# Altium schematic sheet LionIRVT-Base.SchDoc
size A4
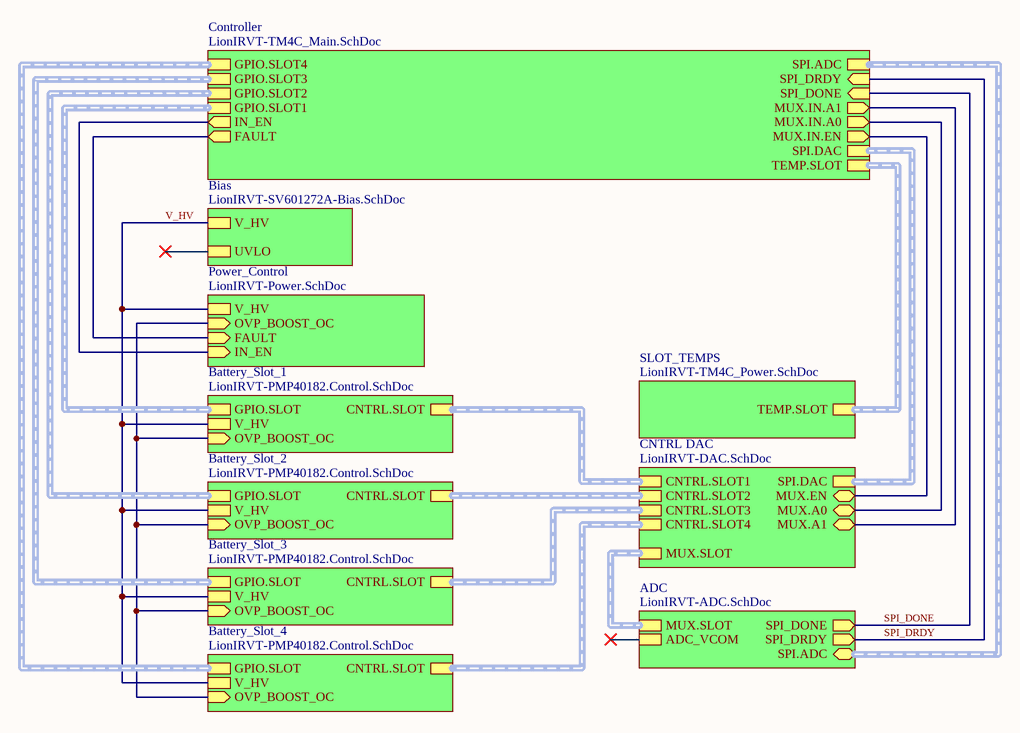
[diagram p0: LionIRVT-Base.SchDoc]

## Sub-sheets
ADC = LionIRVT-ADC.SchDoc: ADC_VCOM, SPI.ADC (bidir, harness SPI), SPI_DRDY (out), SPI_DONE (out), MUX.SLOT (harness MUX.SLOT)
Battery_Slot_1 = LionIRVT-PMP40182.Control.SchDoc: OVP_BOOST_OC (in), V_HV, CNTRL.SLOT (harness CNTRL.SLOT), GPIO.SLOT (harness GPIO.SLOT)
Battery_Slot_2 = LionIRVT-PMP40182.Control.SchDoc: OVP_BOOST_OC (in), V_HV, CNTRL.SLOT (harness CNTRL.SLOT), GPIO.SLOT (harness GPIO.SLOT)
Battery_Slot_3 = LionIRVT-PMP40182.Control.SchDoc: OVP_BOOST_OC (in), V_HV, CNTRL.SLOT (harness CNTRL.SLOT), GPIO.SLOT (harness GPIO.SLOT)
Battery_Slot_4 = LionIRVT-PMP40182.Control.SchDoc: OVP_BOOST_OC (in), V_HV, CNTRL.SLOT (harness CNTRL.SLOT), GPIO.SLOT (harness GPIO.SLOT)
Bias = LionIRVT-SV601272A-Bias.SchDoc: V_HV, UVLO
CNTRL DAC = LionIRVT-DAC.SchDoc: SPI.DAC (harness SPI), MUX.SLOT (harness MUX.SLOT), MUX.A0 (bidir), CNTRL.SLOT1 (harness CNTRL.SLOT), CNTRL.SLOT2 (harness CNTRL.SLOT), MUX.A1 (bidir), CNTRL.SLOT4 (harness CNTRL.SLOT), CNTRL.SLOT3 (harness CNTRL.SLOT), MUX.EN (bidir)
Controller = LionIRVT-TM4C_Main.SchDoc: SPI.DAC (harness SPI), SPI.ADC (harness SPI), SPI_DONE (in), SPI_DRDY (in), MUX.IN.EN (out), MUX.IN.A1 (out), MUX.IN.A0 (out), FAULT (out), IN_EN (out), GPIO.SLOT1 (harness GPIO.SLOT), GPIO.SLOT2 (harness GPIO.SLOT), GPIO.SLOT3 (harness GPIO.SLOT), GPIO.SLOT4 (harness GPIO.SLOT), TEMP.SLOT (harness TEMP.SLOT)
Power_Control = LionIRVT-Power.SchDoc: IN_EN (in), V_HV, OVP_BOOST_OC (in), FAULT (in)
SLOT_TEMPS = LionIRVT-TM4C_Power.SchDoc: TEMP.SLOT (harness TEMP.SLOT)

## Nets
SPI_DONE: sheet ADC/SPI_DONE, sheet Controller/SPI_DONE
SPI_DRDY: sheet ADC/SPI_DRDY, sheet Controller/SPI_DRDY
V_HV: sheet Battery_Slot_1/V_HV, sheet Bias/V_HV, sheet Power_Control/V_HV, sheet Battery_Slot_2/V_HV, sheet Battery_Slot_3/V_HV, sheet Battery_Slot_4/V_HV
(unnamed): sheet CNTRL DAC/MUX.A0, sheet Controller/MUX.IN.A0
(unnamed): sheet CNTRL DAC/MUX.A1, sheet Controller/MUX.IN.A1
(unnamed): sheet CNTRL DAC/MUX.EN, sheet Controller/MUX.IN.EN
(unnamed): sheet Battery_Slot_1/OVP_BOOST_OC, sheet Power_Control/OVP_BOOST_OC, sheet Battery_Slot_2/OVP_BOOST_OC, sheet Battery_Slot_3/OVP_BOOST_OC, sheet Battery_Slot_4/OVP_BOOST_OC
(unnamed): sheet Controller/FAULT, sheet Power_Control/FAULT
(unnamed): sheet Controller/IN_EN, sheet Power_Control/IN_EN

## Buses and harness runs
harness sheet ADC/MUX.SLOT = sheet CNTRL DAC/MUX.SLOT
harness sheet ADC/SPI.ADC = sheet Controller/SPI.ADC
harness sheet Battery_Slot_1/CNTRL.SLOT = sheet CNTRL DAC/CNTRL.SLOT1
harness sheet Battery_Slot_1/GPIO.SLOT = sheet Controller/GPIO.SLOT1
harness sheet Battery_Slot_2/CNTRL.SLOT = sheet CNTRL DAC/CNTRL.SLOT2
harness sheet Battery_Slot_2/GPIO.SLOT = sheet Controller/GPIO.SLOT2
harness sheet Battery_Slot_3/CNTRL.SLOT = sheet CNTRL DAC/CNTRL.SLOT3
harness sheet Battery_Slot_3/GPIO.SLOT = sheet Controller/GPIO.SLOT3
harness sheet Battery_Slot_4/CNTRL.SLOT = sheet CNTRL DAC/CNTRL.SLOT4
harness sheet Battery_Slot_4/GPIO.SLOT = sheet Controller/GPIO.SLOT4
harness sheet CNTRL DAC/SPI.DAC = sheet Controller/SPI.DAC
harness sheet Controller/TEMP.SLOT = sheet SLOT_TEMPS/TEMP.SLOT

## Notes on the sheet
- Title
- Size:
- Date:
- A4
- Number:
- Time:
- Revision:
- Sheet
- of
- File: